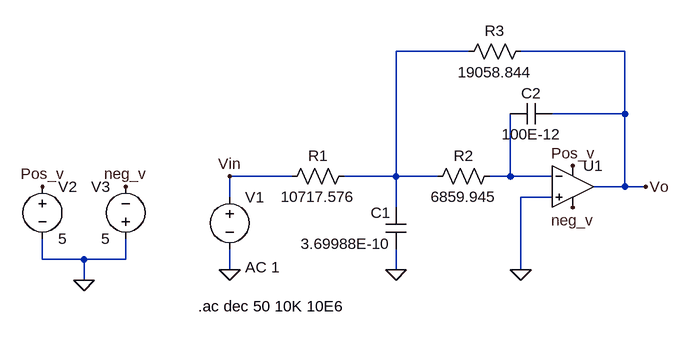
[diagram p0: schematic 2nd order.asc]
2nd order.asc, the LTspice schematic file:
Version 4
SHEET 1 880 680
WIRE -48 -48 -160 -48
WIRE 192 -48 32 -48
WIRE 192 48 192 -48
WIRE 192 48 80 48
WIRE -320 144 -416 144
WIRE -160 144 -160 -48
WIRE -160 144 -240 144
WIRE -96 144 -160 144
WIRE 16 144 16 48
WIRE 16 144 -16 144
WIRE 80 144 16 144
WIRE 192 160 192 48
WIRE 192 160 144 160
WIRE 224 160 192 160
WIRE -416 176 -416 144
WIRE 80 176 32 176
WIRE -160 192 -160 144
WIRE -704 272 -704 240
WIRE -640 272 -704 272
WIRE -576 272 -576 240
WIRE -576 272 -640 272
WIRE -416 288 -416 256
WIRE -160 288 -160 256
WIRE 32 288 32 176
WIRE -640 304 -640 272
FLAG -704 160 Pos_v
FLAG -576 160 neg_v
FLAG -640 304 0
FLAG 32 288 0
FLAG -160 288 0
FLAG -416 288 0
FLAG 112 128 Pos_v
FLAG 112 192 neg_v
FLAG 224 160 Vo
FLAG -416 144 Vin
SYMBOL voltage -704 144 R0
WINDOW 123 0 0 Left 0
WINDOW 39 0 0 Left 0
SYMATTR InstName V2
SYMATTR Value 5
SYMBOL voltage -576 256 R180
WINDOW 0 24 96 Left 2
WINDOW 3 24 16 Left 2
SYMATTR InstName V3
SYMATTR Value 5
SYMBOL Opamps\\UniversalOpamp2 112 160 R0
SYMATTR InstName U1
SYMATTR Value2 Avol=1Meg GBW=1Meg Slew=10Meg
SYMBOL res 48 -64 R90
WINDOW 0 0 56 VBottom 2
WINDOW 3 32 56 VTop 2
SYMATTR InstName R3
SYMATTR Value 19058.844
SYMBOL res 0 128 R90
WINDOW 0 0 56 VBottom 2
WINDOW 3 32 56 VTop 2
SYMATTR InstName R2
SYMATTR Value 6859.945
SYMBOL res -224 128 R90
WINDOW 0 0 56 VBottom 2
WINDOW 3 32 56 VTop 2
SYMATTR InstName R1
SYMATTR Value 10717.576
SYMBOL cap -144 256 R180
WINDOW 0 24 56 Left 2
WINDOW 3 24 8 Left 2
SYMATTR InstName C1
SYMATTR Value 3.69988E-10
SYMBOL cap 16 64 R270
WINDOW 0 32 32 VTop 2
WINDOW 3 0 32 VBottom 2
SYMATTR InstName C2
SYMATTR Value 100E-12
SYMBOL voltage -416 160 R0
WINDOW 123 24 124 Left 2
WINDOW 39 0 0 Left 0
SYMATTR Value2 AC 1
SYMATTR InstName V1
SYMATTR Value ""
TEXT -464 344 Left 2 !.ac dec 50 10K 10E6

The netlist it stands for:
* 2nd order.asc
V2 Pos_v 0 5
V3 0 neg_v 5
XU1 0 N002 Pos_v neg_v Vo level.2 Avol=1Meg GBW=1Meg Slew=10Meg ilimit=25m rail=0 Vos=0 phimargin=45 en=0 enk=0 in=0 ink=0 Rin=500Meg  ; pins IN+ IN- V+ V- OUT
R3 Vo N001 19058.844
R2 N002 N001 6859.945
R1 N001 Vin 10717.576
C1 0 N001 3.69988E-10
C2 N002 Vo 100E-12
V1 Vin 0 AC 1
.ac dec 50 10K 10E6
.lib UniversalOpamps2.sub
.backanno
.end

* Results of the author's LTspice run, read from the files saved beside the schematic
* Operating Point, zero values left out:
*   V(pos_v) = 5 V
*   V(neg_v) = -5 V
*   I(V3) = -500 µA
*   I(V2) = -500 µA
*   Ix(u1:3) = 500 µA
*   Ix(u1:4) = -500 µA
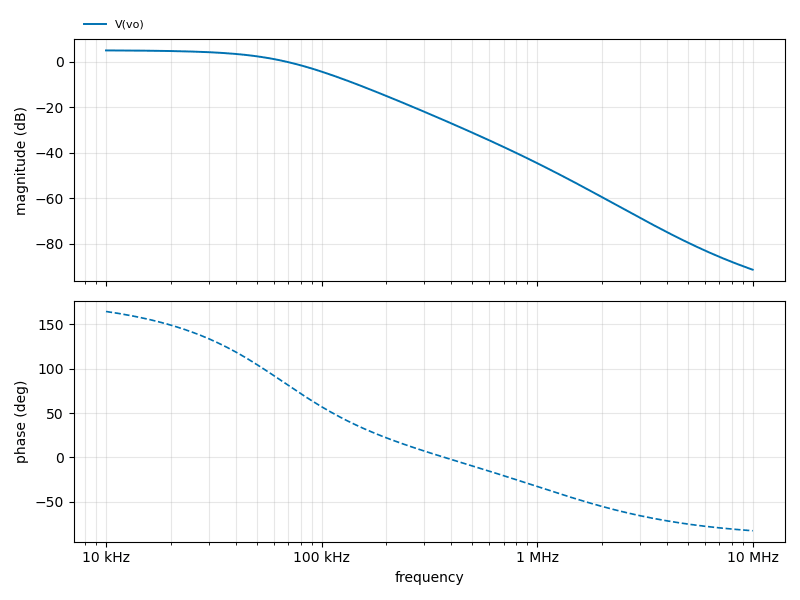
[diagram p1: AC Analysis of 2nd order.asc, plotted from the saved traces]
* AC Analysis, 1 run:
*   V(vo): 4.91 dB at 10 kHz, -91.38 dB at 10 MHz, peak 4.91 dB at 10 kHz, 3 dB below the peak at 53.67 kHz